# Altium project FelineFeast.PrjPcb (part 2 of 2)

## Sheet 4_WiFi.SchDoc: ESP8266-12E WiFi Controller
size A4; DrawnBy: Denis Cooper; Organization: felinefeast.org; Revision: 1.0; SheetNumber: 4; SheetTotal: 5
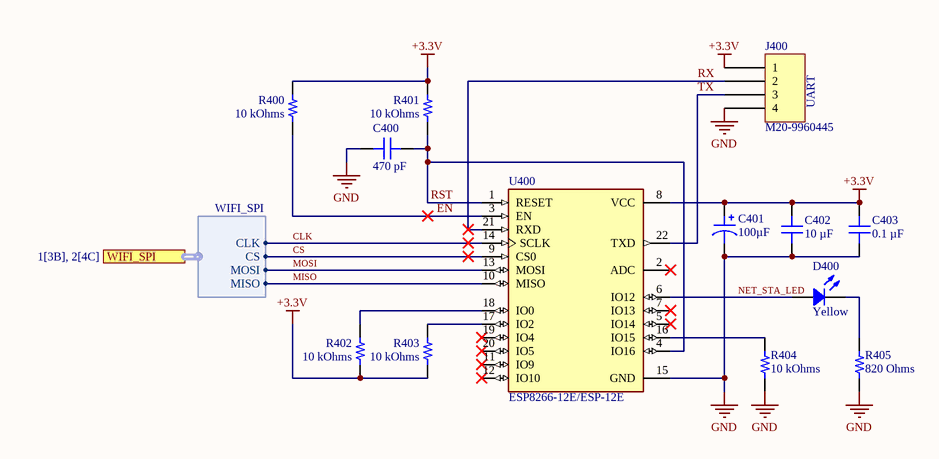
[diagram p3: 4_WiFi.SchDoc]

### Parts
C400  470 pF  [CAP 0603_1608]
C401  100µF  [CAP POL 2917_7343]
C402  10 µF  [CAP 0805_2012]
C403  0.1 µF  [CAP 0603_1608]
D400  Yellow  [LED 0603_1608 YELLOW]
J400  M20-9960445  [HARWIN M20-9960445]
R400  10 kOhms  [RES 0603_1608]
R401  10 kOhms  [RES 0603_1608]
R402  10 kOhms  [RES 0603_1608]
R403  10 kOhms  [RES 0603_1608]
R404  10 kOhms  [RES 0603_1608]
R405  820 Ohms  [RES 0603_1608]
U400  ESP8266-12E/ESP-12E  [XCVR_ESP8266-12E/ESP-12E]

### Ports
WIFI_SPI (harness WIFI_SPI, see 1[3B], 2[4C])

### Harnesses
WIFI_SPI: CLK, CS, MOSI, MISO

### Nets
+3.3V: C401.1 C402.1 C403.2 J400.1 R400.2 R401.2 R402.1 R403.1 U400.8(VCC)
GND: C400.1 C401.2 C402.2 C403.1 J400.4 R404.1 R405.1 U400.15(GND)
CLK: U400.14(SCLK) ; port WIFI_SPI.CLK
CS: U400.9(CS0) ; port WIFI_SPI.CS
EN: R400.1 U400.3(EN)
MISO: U400.10(MISO) ; port WIFI_SPI.MISO
MOSI: U400.13(MOSI) ; port WIFI_SPI.MOSI
NET_STA_LED: D400.1 U400.6(IO12)
RST: C400.2 R401.1 U400.1(RESET) U400.4(IO16)
RX: J400.2 U400.21(RXD)
TX: J400.3 U400.22(TXD)
NetD400_2: D400.2 R405.2
NetR402_2: R402.2 U400.18(IO0)
NetR403_2: R403.2 U400.17(IO2)
NetR404_2: R404.2 U400.16(IO15)

Not connected (* = marked no-connect by the designer): U400 2(ADC)* 5(IO14)* 7(IO13)* 11(IO9)* 12(IO10)* 19(IO4)* 20(IO5)*

### Notes on the sheet
- (near J400) UART

### Library data of the parts
C400 = CL10B471KB8NNNC: CAP CER 470PF 50V X7R 0603; manufacturer: Samsung Electro-Mechanics; Tolerance: ±10%; Part Number: CL10B471KB8NNNC; Capacitance: 470 pF; Applications: General Purpose; componentlink1description: Datasheet; componentlink1url: http://www.samsungsem.com/kr/support/product-search/mlcc/CL10B471KB8NNNC.jsp; componentlink2description: DigiKey Link; componentlink2url: https://www.digikey.com/en/products/detail/samsung-electro-mechanics/CL10B471KB8NNNC/3886752; Device Package: 0603 (1608 Metric); lastupdated: 09.02.2024 20:10:20; Lifecycle Status: Active; Minimum Order: 1; Mounting Type: Surface Mount, MLCC; Operating Temperature: -55°C ~ 125°C; Package / Case: 0603 (1608 Metric); packaging: TapeAndReel; partid: 9822; Part Status: Active; price: 0.01; series: CL; Size / Dimension: 0.063" L x 0.031" W (1.60mm x 0.80mm); Supplier 1: DigiKey; Supplier Part Number 1: 1276-1094-1-ND; Temperature Coefficient: X7R; Thickness (Max): 0.035" (0.90mm); value: 470 pF; Voltage - Rated: 50V
C401 = TAJD107K016RNJ: CAP TANT 100UF 10% 16V 2917; manufacturer: AVX Corporation; Manufacturer Size Code: D; ESR (Equivalent Series Resistance): 600mOhm; Type: Molded; Part Number: TAJD107K016RNJ; Value: 100µF; Capacitance: 100µF; componentlink1description: Datasheet; componentlink1url: http://datasheets.avx.com/TAJ.pdf; componentlink2description: DigiKey Link; componentlink2url: http://digikey.com/product-detail/en/avx-corporation/TAJD107K016RNJ/478-1723-1-ND/564755; Device Package: 2917 (7343 Metric); Features: General Purpose; Height - Seated (Max): 0.122" (3.10mm); lastupdated: 02.09.2020 1:16:19; Lifecycle Status: Active; Minimum Order: 1; Mounting Type: Surface Mount; Operating Temperature: -55°C ~ 125°C; Package / Case: 2917 (7343 Metric); packaging: TapeAndReel; partid: 1445; Part Status: Active; price: 0.35; series: TAJ; Size / Dimension: 0.287" L x 0.169" W (7.30mm x 4.30mm); Supplier 1: DigiKey; Supplier Part Number 1: 478-1723-1-ND; Tolerance: ±10%; Voltage - Rated: 16V
C402 = CL21B106KPQNNNE: CAP CER 10UF 10V X7R 0805; manufacturer: Samsung Electro-Mechanics; Tolerance: ±10%; Part Number: CL21B106KPQNNNE; Capacitance: 10 µF; Applications: General Purpose; componentlink1description: Datasheet; componentlink1url: http://www.samsungsem.com/kr/support/product-search/mlcc/CL21B106KPQNNNE.jsp; componentlink2description: DigiKey Link; componentlink2url: https://www.digikey.com/en/products/detail/samsung-electro-mechanics/CL21B106KPQNNNE/3887422; Device Package: 0805 (2012 Metric); lastupdated: 09.02.2024 20:15:41; Lifecycle Status: Active; Minimum Order: 1; Mounting Type: Surface Mount, MLCC; Operating Temperature: -55°C ~ 125°C; Package / Case: 0805 (2012 Metric); packaging: TapeAndReel; partid: 13130; Part Status: Active; price: 0.02; series: CL; Size / Dimension: 0.079" L x 0.049" W (2.00mm x 1.25mm); Supplier 1: DigiKey; Supplier Part Number 1: 1276-1764-1-ND; Temperature Coefficient: X7R; Thickness (Max): 0.055" (1.40mm); value: 10 µF; Voltage - Rated: 10V
C403 = CL10B104KA8NNNC: CAP CER 0.1UF 25V X7R 0603; manufacturer: Samsung Electro-Mechanics; Tolerance: ±10%; Part Number: CL10B104KA8NNNC; Capacitance: 0.1 µF; Applications: General Purpose; componentlink1description: Datasheet; componentlink1url: http://www.samsungsem.com/kr/support/product-search/mlcc/CL10B104KA8NNNC.jsp; componentlink2description: DigiKey Link; componentlink2url: https://www.digikey.com/en/products/detail/samsung-electro-mechanics/CL10B104KA8NNNC/3886664; Device Package: 0603 (1608 Metric); lastupdated: 09.02.2024 20:10:20; Lifecycle Status: Active; Minimum Order: 1; Mounting Type: Surface Mount, MLCC; Operating Temperature: -55°C ~ 125°C; Package / Case: 0603 (1608 Metric); packaging: TapeAndReel; partid: 9793; Part Status: Active; price: 0.01; series: CL; Size / Dimension: 0.063" L x 0.031" W (1.60mm x 0.80mm); Supplier 1: DigiKey; Supplier Part Number 1: 1276-1006-1-ND; Temperature Coefficient: X7R; Thickness (Max): 0.035" (0.90mm); value: 0.1 µF; Voltage - Rated: 25V
D400 = LY L29K-H1K2-26-Z: LED YELLOW DIFFUSED 0603 SMD; Manufacturer: OSRAM Opto Semiconductors Inc.; Configuration: Standard; Current - Test: 2mA; Lens Color: White; Lens Size: 1.30mm x 0.80mm; Lens Style: Rectangle with Flat Top; Millicandela Rating: 7mcd; Viewing Angle: 160°; Voltage - Forward (Vf) (Typ): 1.8V; Wavelength - Dominant: 587nm; Wavelength - Peak: 591nm; Part Number: LY L29K-H1K2-26-Z; Color: Yellow; ComponentLink1Description: Datasheet; ComponentLink1URL: https://dammedia.osram.info/media/resource/hires/osram-dam-2492957/LY%20L29K.pdf; ComponentLink2Description: DigiKey Link; ComponentLink2URL: https://www.digikey.com/en/products/detail/osram-opto-semiconductors-inc/LY-L29K-H1K2-26-Z/810340; Device Package: 0603 (1608 Metric); Height (Max): 0.65mm; LastUpdated: 03.06.2024 20:01:09; Lens Transparency: Diffused; Lifecycle Status: Active; Minimum Order: 1; Mounting Type: Surface Mount; Package / Case: 0603 (1608 Metric); Packaging: TapeAndReel; PartId: 140; Part Status: Active; Price: 0.07; Series: SMARTLED® 0603; Size / Dimension: 1.70mm L x 0.80mm W; Supplier 1: DigiKey; Supplier Part Number 1: 475-1196-1-ND; Supplier Device Package: 0603; Value: Yellow
J400 = M20-9960445: CONN HEADER R/A 4POS 2.54MM; Manufacturer: Harwin Inc.; Connector Type: Header, Cuttable; Contact Length - Mating: 0.240" (6.10mm); Contact Length - Post: 0.118" (3.00mm); Current Rating (Amps): 3A per Contact; Material Flammability Rating: UL94 V-0; Number of Positions: 4; Number of Positions Loaded: All; Pitch - Mating: 0.100" (2.54mm); Row Spacing - Mating: -40°C ~ 105°C; Shrouding: Unshrouded; Style: Board to Board or Cable; Part Number: M20-9960445; ComponentLink1Description: Datasheet; ComponentLink1URL: https://cdn.harwin.com/pdfs/Harwin_PC_Connectors_M20.pdf; ComponentLink2Description: DigiKey Link; ComponentLink2URL: https://www.digikey.com/en/products/detail/harwin-inc/M20-9960445/3921052; Contact Finish - Mating: Gold; Contact Material: Brass; Contact Shape: Square; Contact Type: Male Pin; Fastening Type: Push-Pull; Insulation Color: Black; Insulation Height: 0.100" (2.54mm); Insulation Material: Polyamide (PA6T), Nylon 6T; LastUpdated: 21.09.2022 19:23:20; Lifecycle Status: Active; Minimum Order: 1; Mounting Type: Through Hole, Right Angle; Number of Rows: 1; Operating Temperature: -40°C ~ 105°C; Packaging: Bulk; PartId: 167; Part Status: Active; Price: 0.11; Series: M20; Supplier 1: DigiKey; Supplier Part Number 1: 952-3286-ND; Termination: Solder
R400-R404 = ERJ-P03F1002V: RES SMD 10 KOHM 1% 1/5W 0603; Manufacturer: Panasonic Electronic Components; Power (Watts): 0.2W, 1/5W; Temperature Coefficient: ±200ppm/°C; Part Number: ERJ-P03F1002V; Value: 10 kOhms; ComponentLink1Description: Datasheet; ComponentLink1URL: https://industrial.panasonic.com/cdbs/www-data/pdf/RDO0000/AOA0000C331.pdf; ComponentLink2Description: DigiKey Link; ComponentLink2URL: https://www.digikey.com/en/products/detail/panasonic-electronic-components/ERJ-P03F1002V/9810215; Composition: Thick Film; Device Package: 0603 (1608 Metric); Features: Automotive AEC-Q200, Pulse Withstanding; Height - Seated (Max): 0.022" (0.55mm); LastUpdated: 09.02.2024 20:40:33; Lifecycle Status: Active; Minimum Order: 1; Number of Terminations: 2; Operating Temperature: -55°C ~ 155°C; Package / Case: 0603 (1608 Metric); Packaging: TapeAndReel; PartId: 82212; Price: 0.03; Ratings: AEC-Q200; Resistance: 10 kOhms; Series: ERJ-P03; Size / Dimension: 0.063" L x 0.031" W (1.60mm x 0.80mm); Supplier 1: DigiKey; Supplier Part Number 1: 10-ERJ-P03F1002VCT-ND; Supplier Device Package: 0603; Tolerance: ±1%
R405 = ERJ-3EKF8200V: RES SMD 820 OHM 1% 1/10W 0603; Manufacturer: Panasonic Electronic Components; Power (Watts): 0.1W, 1/10W; Temperature Coefficient: ±100ppm/°C; Part Number: ERJ-3EKF8200V; Value: 820 Ohms; ComponentLink1Description: Datasheet; ComponentLink1URL: https://industrial.panasonic.com/cdbs/www-data/pdf/RDA0000/AOA0000C304.pdf; ComponentLink2Description: DigiKey Link; ComponentLink2URL: https://www.digikey.com/en/products/detail/panasonic-electronic-components/ERJ-3EKF8200V/1746447; Composition: Thick Film; Device Package: 0603 (1608 Metric); Features: Automotive AEC-Q200; Height - Seated (Max): 0.022" (0.55mm); LastUpdated: 09.02.2024 20:41:57; Lifecycle Status: Active; Minimum Order: 1; Number of Terminations: 2; Operating Temperature: -55°C ~ 155°C; Package / Case: 0603 (1608 Metric); Packaging: TapeAndReel; PartId: 25993; Part Status: Active; Price: 0.01; Ratings: AEC-Q200; Resistance: 820 Ohms; Series: ERJ-3EK; Size / Dimension: 0.063" L x 0.031" W (1.60mm x 0.80mm); Supplier 1: DigiKey; Supplier Part Number 1: P820HCT-ND; Supplier Device Package: 0603; Tolerance: ±1%
U400 = ESP8266-12E/ESP-12E: This WiFi module has a 32-bit MCU micro and clock speeds supporting 80 MHz or 160 MHz. Supports the RTOS and integrated Wi-Fi MAC/BB/RF/PA/LNA, and has an on-board antenna.; MF: AI-Thinker; Value: *; SnapEDA_Link: https://www.snapeda.com/parts/ESP8266-12E/ESP-12E/AI-Thinker/view-part/?ref=snap; Availability: Not in stock; Price: None; Package: None; Check_prices: https://www.snapeda.com/parts/ESP8266-12E/ESP-12E/AI-Thinker/view-part/?ref=eda; MP: ESP8266-12E/ESP-12E

## Sheet 5_StepperMotorDriver.SchDoc: Stepper Motor Driver
size A4; DrawnBy: Denis Cooper; Organization: felinefeast.org; Revision: 1.0; SheetNumber: 5; SheetTotal: 5
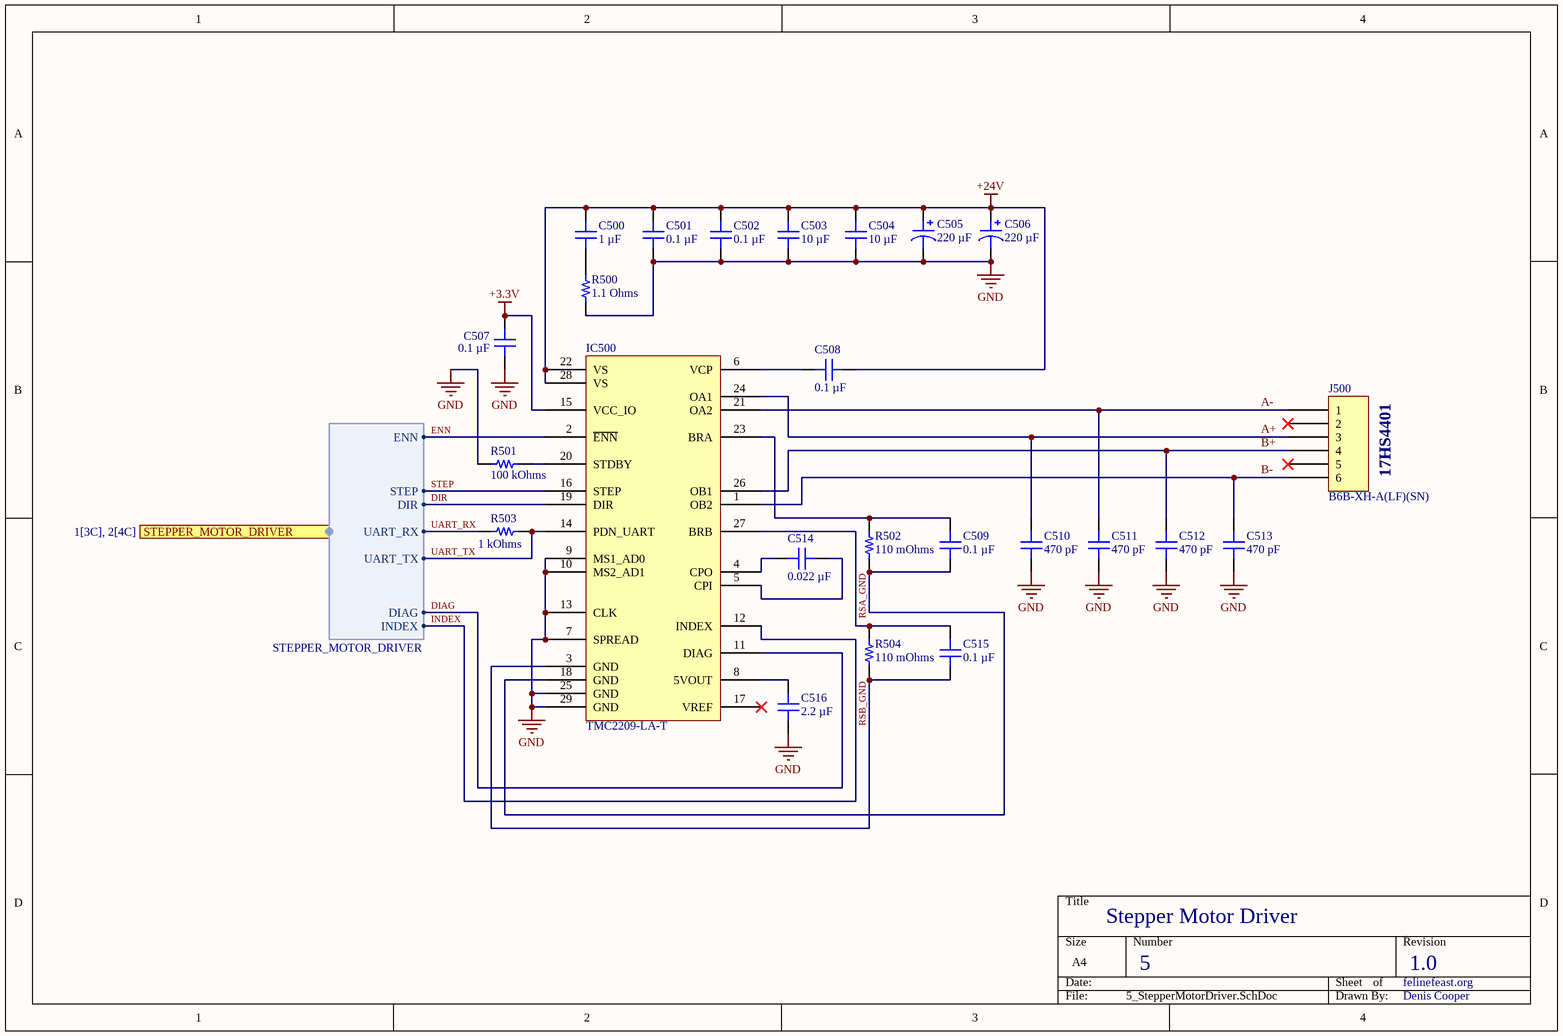
[diagram p4: 5_StepperMotorDriver.SchDoc]

### Parts
C500  1 µF  [CAP 1210_3225 - 1MM]
C501  0.1 µF  [CAP 0603_1608]
C502  0.1 µF  [CAP 0603_1608]
C503  10 µF  [CAP 1206_3216 - 0.8MM]
C504  10 µF  [CAP 1206_3216 - 0.8MM]
C505  220 µF  [CAP ALSMD 8.3MM H10.5MM]
C506  220 µF  [CAP ALSMD 8.3MM H10.5MM]
C507  0.1 µF  [CAP 0603_1608]
C508  0.1 µF  [CAP 0603_1608]
C509  0.1 µF  [CAP 0603_1608]
C510  470 pF  [CAP 0603_1608]
C511  470 pF  [CAP 0603_1608]
C512  470 pF  [CAP 0603_1608]
C513  470 pF  [CAP 0603_1608]
C514  0.022 µF  [CAP 0603_1608]
C515  0.1 µF  [CAP 0603_1608]
C516  2.2 µF  [CAP 0603_1608]
IC500  TMC2209-LA-T  [TRINAMIC QFN28 TMC2209-LA]
J500  B6B-XH-A(LF)(SN)  [JST XH B6B-XH-A]
R500  1.1 Ohms  [YAGEO RES 0603_1608]
R501  100 kOhms  [RES 0603_1608]
R502  110 mOhms  [RES 1210_3225]
R503  1 kOhms  [RES 0603_1608]
R504  110 mOhms  [RES 1210_3225]

### Ports
STEPPER_MOTOR_DRIVER (harness STEPPER_MOTOR_DRIVER, see 1[3C], 2[4C])

### Harnesses
STEPPER_MOTOR_DRIVER: STEP, DIR, UART_TX, ENN, INDEX, DIAG, UART_RX

### Nets
+3.3V: C507.2 IC500.15(VCC_IO)
+24V: C500.2 C501.2 C502.2 C503.2 C504.2 C505.1 C506.1 C508.1 IC500.22(VS) IC500.28(VS)
GND: C501.1 C502.1 C503.1 C504.1 C505.2 C506.2 C507.1 C510.1 C511.1 C512.1 C513.1 C516.1 IC500.7(SPREAD) IC500.9(MS1_AD0) IC500.10(MS2_AD1) IC500.13(CLK) IC500.25(GND) IC500.29(GND) R500.1 R501.2
A+: C510.2 IC500.24(OA1) J500.3
A-: C511.2 IC500.21(OA2) J500.1
B+: C512.2 IC500.26(OB1) J500.4
B-: C513.2 IC500.1(OB2) J500.6
DIAG: IC500.11(DIAG) ; port STEPPER_MOTOR_DRIVER.DIAG
DIR: IC500.19(DIR) ; port STEPPER_MOTOR_DRIVER.DIR
ENN: IC500.2(~{ENN}) ; port STEPPER_MOTOR_DRIVER.ENN
INDEX: IC500.12(INDEX) ; port STEPPER_MOTOR_DRIVER.INDEX
RSA_GND: C509.2 IC500.18(GND) R502.1
RSB_GND: C515.2 IC500.3(GND) R504.1
STEP: IC500.16(STEP) ; port STEPPER_MOTOR_DRIVER.STEP
UART_RX: R503.1 ; port STEPPER_MOTOR_DRIVER.UART_RX
UART_TX: IC500.14(PDN_UART) R503.2 ; port STEPPER_MOTOR_DRIVER.UART_TX
NetC500_1: C500.1 R500.2
NetC508_2: C508.2 IC500.6(VCP)
NetC509_1: C509.1 IC500.23(BRA) R502.2
NetC514_1: C514.1 IC500.4(CPO)
NetC514_2: C514.2 IC500.5(CPI)
NetC515_1: C515.1 IC500.27(BRB) R504.2
NetC516_2: C516.2 IC500.8(5VOUT)
NetIC500_20: IC500.20(STDBY) R501.1

Not connected (* = marked no-connect by the designer): IC500 17(VREF)*; J500 2* 5*

### Notes on the sheet
- (near J500) 17HS4401

### Library data of the parts
C500 = CL32B105KBHNNNE: CAP CER 1UF 50V X7R 1210; manufacturer: Samsung Electro-Mechanics; Tolerance: ±10%; Part Number: CL32B105KBHNNNE; Value: 1 µF; Applications: General Purpose; Capacitance: 1 µF; componentlink1description: Datasheet; componentlink1url: http://www.samsungsem.com/kr/support/product-search/mlcc/CL32B105KBHNNNE.jsp; componentlink2description: DigiKey Link; componentlink2url: https://www.digikey.com/en/products/detail/samsung-electro-mechanics/CL32B105KBHNNNE/3887469; Device Package: 1210 (3225 Metric); lastupdated: 04.06.2024 19:21:02; Lifecycle Status: Active; Minimum Order: 1; Mounting Type: Surface Mount, MLCC; Operating Temperature: -55°C ~ 125°C; Package / Case: 1210 (3225 Metric); packaging: TapeAndReel; partid: 24761; Part Status: Active; price: 0.03; series: CL; Size / Dimension: 0.126" L x 0.098" W (3.20mm x 2.50mm); Supplier 1: DigiKey; Supplier Part Number 1: 1276-1811-1-ND; Temperature Coefficient: X7R; Thickness (Max): 0.071" (1.80mm); Voltage - Rated: 50V
C501 C502 C507-C509 C515 = CL10B104KB8NNNC: CAP CER 0.1UF 50V X7R 0603; manufacturer: Samsung Electro-Mechanics; Tolerance: ±10%; Part Number: CL10B104KB8NNNC; Capacitance: 0.1 µF; Applications: General Purpose; componentlink1description: Datasheet; componentlink1url: http://www.samsungsem.com/kr/support/product-search/mlcc/CL10B104KB8NNNC.jsp; componentlink2description: DigiKey Link; componentlink2url: https://www.digikey.com/en/products/detail/samsung-electro-mechanics/CL10B104KB8NNNC/3886658; Device Package: 0603 (1608 Metric); lastupdated: 09.02.2024 20:10:20; Lifecycle Status: Active; Minimum Order: 1; Mounting Type: Surface Mount, MLCC; Operating Temperature: -55°C ~ 125°C; Package / Case: 0603 (1608 Metric); packaging: TapeAndReel; partid: 9788; Part Status: Active; price: 0.01; series: CL; Size / Dimension: 0.063" L x 0.031" W (1.60mm x 0.80mm); Supplier 1: DigiKey; Supplier Part Number 1: 1276-1000-1-ND; Temperature Coefficient: X7R; Thickness (Max): 0.035" (0.90mm); value: 0.1 µF; Voltage - Rated: 50V
C503 C504 = CL31B106KBHNNNE: CAP CER 10UF 50V X7R 1206; manufacturer: Samsung Electro-Mechanics; Tolerance: ±10%; Part Number: CL31B106KBHNNNE; Capacitance: 10 µF; Applications: General Purpose; componentlink1description: Datasheet; componentlink1url: http://www.samsungsem.com/kr/support/product-search/mlcc/CL31B106KBHNNNE.jsp; componentlink2description: DigiKey Link; componentlink2url: https://www.digikey.com/en/products/detail/samsung-electro-mechanics/CL31B106KBHNNNE/5961251; Device Package: 1206 (3216 Metric); lastupdated: 04.06.2024 19:10:41; Lifecycle Status: Active; Minimum Order: 1; Mounting Type: Surface Mount, MLCC; Operating Temperature: -55°C ~ 125°C; Package / Case: 1206 (3216 Metric); packaging: TapeAndReel; partid: 40563; Part Status: Active; price: 0.06; series: CL; Size / Dimension: 0.126" L x 0.063" W (3.20mm x 1.60mm); Supplier 1: DigiKey; Supplier Part Number 1: 1276-6767-1-ND; Temperature Coefficient: X7R; Thickness (Max): 0.071" (1.80mm); value: 10 µF; Voltage - Rated: 50V
C505 C506 = EEE-FT1H221GP: CAP ALUM 220UF 20% 50V SMD; manufacturer: Panasonic Electronic Components; ESR (Equivalent Series Resistance): 180mOhm @ 100kHz; Lifetime @ Temp.: 5000 Hrs @ 105°C; Polarization: Polar; Ripple Current @ High Frequency: 670 mA @ 100 kHz; Ripple Current @ Low Frequency: 435.5 mA @ 120 Hz; Surface Mount Land Size: 0.327" L x 0.327" W (8.30mm x 8.30mm); Part Number: EEE-FT1H221GP; Applications: Automotive; Capacitance: 220 µF; componentlink1description: Datasheet; componentlink1url: https://na.industrial.panasonic.com/file-download/3112; componentlink2description: DigiKey Link; componentlink2url: https://www.digikey.com/en/products/detail/panasonic-electronic-components/EEE-FT1H221GP/6048908; Device Package: Radial, Can - SMD; Height - Seated (Max): 0.413" (10.50mm); lastupdated: 03.06.2024 20:15:48; Lifecycle Status: Active; Minimum Order: 1; Mounting Type: Surface Mount; Operating Temperature: -55°C ~ 105°C; Package / Case: Radial, Can - SMD; packaging: TapeAndReel; partid: 7501; Part Status: Active; price: 0.33; Ratings: AEC-Q200; series: FT; Size / Dimension: 0.315" Dia (8.00mm); Supplier 1: DigiKey; Supplier Part Number 1: PCE5120CT-ND; Tolerance: ±20%; value: 220 µF; Voltage - Rated: 50 V
C510-C513 = CL10C471JB8NNNC: CAP CER 470PF 50V C0G/NP0 0603; manufacturer: Samsung Electro-Mechanics; Temperature Coefficient: C0G, NP0; Tolerance: ±5%; Part Number: CL10C471JB8NNNC; Capacitance: 470 pF; Applications: General Purpose; componentlink1description: Datasheet; componentlink1url: http://www.samsungsem.com/kr/support/product-search/mlcc/CL10C471JB8NNNC.jsp; componentlink2description: DigiKey Link; componentlink2url: https://www.digikey.com/en/products/detail/samsung-electro-mechanics/CL10C471JB8NNNC/3886826; Device Package: 0603 (1608 Metric); lastupdated: 09.02.2024 20:10:27; Lifecycle Status: Active; Minimum Order: 1; Mounting Type: Surface Mount, MLCC; Operating Temperature: -55°C ~ 125°C; Package / Case: 0603 (1608 Metric); packaging: TapeAndReel; partid: 5135; Part Status: Active; price: 0.01; series: CL; Size / Dimension: 0.063" L x 0.031" W (1.60mm x 0.80mm); Supplier 1: DigiKey; Supplier Part Number 1: 1276-1168-1-ND; Thickness (Max): 0.035" (0.90mm); value: 470 pF; Voltage - Rated: 50V
C514 = CL10B223KB8NNNC: CAP CER 0.022UF 50V X7R 0603; manufacturer: Samsung Electro-Mechanics; Tolerance: ±10%; Part Number: CL10B223KB8NNNC; Capacitance: 0.022 µF; Applications: General Purpose; componentlink1description: Datasheet; componentlink1url: http://www.samsungsem.com/kr/support/product-search/mlcc/CL10B223KB8NNNC.jsp; componentlink2description: DigiKey Link; componentlink2url: https://www.digikey.com/en/products/detail/samsung-electro-mechanics/CL10B223KB8NNNC/3886762; Device Package: 0603 (1608 Metric); lastupdated: 09.02.2024 20:10:20; Lifecycle Status: Active; Minimum Order: 1; Mounting Type: Surface Mount, MLCC; Operating Temperature: -55°C ~ 125°C; Package / Case: 0603 (1608 Metric); packaging: TapeAndReel; partid: 9905; Part Status: Active; price: 0.01; series: CL; Size / Dimension: 0.063" L x 0.031" W (1.60mm x 0.80mm); Supplier 1: DigiKey; Supplier Part Number 1: 1276-1104-1-ND; Temperature Coefficient: X7R; Thickness (Max): 0.035" (0.90mm); value: 0.022 µF; Voltage - Rated: 50V
C516 = CL10A225KQ8NNNC: CAP CER 2.2UF 6.3V X5R 0603; manufacturer: Samsung Electro-Mechanics; Tolerance: ±10%; Part Number: CL10A225KQ8NNNC; Capacitance: 2.2 µF; Applications: General Purpose; componentlink1description: Datasheet; componentlink1url: http://www.samsungsem.com/kr/support/product-search/mlcc/CL10A225KQ8NNNC.jsp; componentlink2description: DigiKey Link; componentlink2url: https://www.digikey.com/en/products/detail/samsung-electro-mechanics/CL10A225KQ8NNNC/3886841; Device Package: 0603 (1608 Metric); lastupdated: 09.02.2024 20:10:16; Lifecycle Status: Active; Minimum Order: 1; Mounting Type: Surface Mount, MLCC; Operating Temperature: -55°C ~ 85°C; Package / Case: 0603 (1608 Metric); packaging: TapeAndReel; partid: 13106; Part Status: Active; price: 0.01; series: CL; Size / Dimension: 0.063" L x 0.031" W (1.60mm x 0.80mm); Supplier 1: DigiKey; Supplier Part Number 1: 1276-1183-1-ND; Temperature Coefficient: X5R; Thickness (Max): 0.035" (0.90mm); value: 2.2 µF; Voltage - Rated: 6.3V
IC500 = TMC2209-LA-T: IC MTR DRV 4.75-28V QFN28; Manufacturer: Trinamic Motion Control GmbH; Current - Output: 2A; Function: Driver - Fully Integrated, Control and Power Stage; Interface: Step/Direction, UART; Motor Type - Stepper: Bipolar; Output Configuration: Step/Direction; Step Resolution: 1 ~ 1/256; Voltage - Load: 5.5V ~ 29V; Voltage - Supply: 4.8V ~ 5.25V; Part Number: TMC2209-LA-T; Applications: Automation Control; ComponentLink1Description: Datasheet; ComponentLink1URL: https://www.trinamic.com/fileadmin/assets/Products/ICs_Documents/TMC2209_Datasheet_V103.pdf; ComponentLink2Description: DigiKey Link; ComponentLink2URL: https://www.digikey.com/en/products/detail/trinamic-motion-control-gmbh/TMC2209-LA-T/10232491; LastUpdated: 01.10.2022 11:24:54; Lifecycle Status: Active; Minimum Order: 1; Mounting Type: Surface Mount; Operating Temperature: -40°C ~ 125°C (TJ); Package / Case: 28-VFQFN Exposed Pad; Packaging: TapeAndReel; PartId: 13; Part Status: Active; Price: 1.91; Series: stallGuard™; Supplier 1: DigiKey; Supplier Part Number 1: 1460-1398-1-ND; Supplier Device Package: 28-QFN (5x5); Technology: Power MOSFET
J500 = B6B-XH-A(LF)(SN): CONN HEADER VERT 6POS 2.5MM; Manufacturer: JST Sales America Inc.; Contact Length - Post: 0.134" (3.40mm); Current Rating (Amps): 3A; Material Flammability Rating: UL94 V-0; Number of Positions: 6; Number of Positions Loaded: All; Pitch - Mating: 0.098" (2.50mm); Shrouding: Shrouded - 4 Wall; Style: Board to Cable/Wire; Voltage Rating: 250V; Part Number: B6B-XH-A(LF)(SN); ComponentLink1Description: Datasheet; ComponentLink1URL: http://www.jst-mfg.com/product/pdf/eng/eXH.pdf; ComponentLink2Description: DigiKey Link; ComponentLink2URL: http://digikey.com/product-detail/en/jst-sales-america-inc/B6B-XH-A-LF-SN/455-2271-ND/1000381; Connector Type: Header; Contact Finish - Mating: Tin; Contact Finish - Post: Tin; Contact Material: Brass; Contact Shape: Square; Contact Type: Male Pin; Fastening Type: Detent Lock; Insulation Color: Natural; Insulation Height: 0.276" (7.00mm); Insulation Material: Polyamide (PA66), Nylon 6/6; LastUpdated: 12.01.2020 23:46:58; Lifecycle Status: Active; Minimum Order: 1; Mounting Type: Through Hole; Number of Rows: 1; Operating Temperature: -25°C ~ 85°C; Packaging: Bulk; PartId: 71; Part Status: Active; Price: 0.27; Series: XH; Supplier 1: DigiKey; Supplier Part Number 1: 455-2271-ND; Termination: Press-Fit, Solder
R500 = RC0603FR-071R1L: RES 1.1 OHM 1% 1/10W 0603; Manufacturer: Yageo; Power (Watts): 0.1W, 1/10W; Temperature Coefficient: ±200ppm/°C; Part Number: RC0603FR-071R1L; Value: 1.1 Ohms; ComponentLink1Description: Datasheet; ComponentLink1URL: https://www.yageo.com/upload/media/product/productsearch/datasheet/rchip/PYu-RC_Group_51_RoHS_L_11.pdf; ComponentLink2Description: DigiKey Link; ComponentLink2URL: https://www.digikey.com/en/products/detail/yageo/RC0603FR-071R1L/5918279; Composition: Thick Film; Device Package: 0603 (1608 Metric); Features: Moisture Resistant; Height - Seated (Max): 0.022" (0.55mm); LastUpdated: 25.07.2024 9:19:12; Lifecycle Status: Active; Minimum Order: 1; Number of Terminations: 2; Operating Temperature: -55°C ~ 155°C; Package / Case: 0603 (1608 Metric); Packaging: TapeAndReel; PartId: 61999; Part Status: Active; Price: 0.01; Resistance: 1.1 Ohms; Series: RC_L; Size / Dimension: 0.063" L x 0.031" W (1.60mm x 0.80mm); Supplier 1: DigiKey; Supplier Part Number 1: 13-RC0603FR-071R1LCT-ND; Supplier Device Package: 0603; Tolerance: ±1%
R501 = ERJ-3EKF1003V: RES SMD 100K OHM 1% 1/10W 0603; Manufacturer: Panasonic Electronic Components; Power (Watts): 0.1W, 1/10W; Temperature Coefficient: ±100ppm/°C; Part Number: ERJ-3EKF1003V; Value: 100 kOhms; ComponentLink1Description: Datasheet; ComponentLink1URL: https://industrial.panasonic.com/cdbs/www-data/pdf/RDA0000/AOA0000C304.pdf; ComponentLink2Description: DigiKey Link; ComponentLink2URL: https://www.digikey.com/en/products/detail/panasonic-electronic-components/ERJ-3EKF1003V/196075; Composition: Thick Film; Device Package: 0603 (1608 Metric); Features: Automotive AEC-Q200; Height - Seated (Max): 0.022" (0.55mm); LastUpdated: 09.02.2024 20:41:59; Lifecycle Status: Active; Minimum Order: 1; Number of Terminations: 2; Operating Temperature: -55°C ~ 155°C; Package / Case: 0603 (1608 Metric); Packaging: TapeAndReel; PartId: 25699; Part Status: Active; Price: 0.01; Ratings: AEC-Q200; Resistance: 100 kOhms; Series: ERJ-3EK; Size / Dimension: 0.063" L x 0.031" W (1.60mm x 0.80mm); Supplier 1: DigiKey; Supplier Part Number 1: P100KHCT-ND; Supplier Device Package: 0603; Tolerance: ±1%
R502 R504 = RL1210FR-070R11L: RES 0.11 OHM 1% 1/2W 1210; Manufacturer: Yageo; Power (Watts): 0.5W, 1/2W; Temperature Coefficient: ±600ppm/°C; Part Number: RL1210FR-070R11L; ComponentLink1Description: Datasheet; ComponentLink1URL: https://www.yageo.com/upload/media/product/app/datasheet/rchip/pyu-rl_group_521_rohs_l.pdf; ComponentLink2Description: DigiKey Link; ComponentLink2URL: https://www.digikey.com/en/products/detail/yageo/RL1210FR-070R11L/5925206; Composition: Thick Film; Device Package: 1210 (3225 Metric); Features: Automotive AEC-Q200, Current Sense, Moisture Resistant; Height - Seated (Max): 0.026" (0.65mm); LastUpdated: 03.06.2024 20:18:34; Lifecycle Status: Active; Minimum Order: 1; Number of Terminations: 2; Operating Temperature: -55°C ~ 155°C; Package / Case: 1210 (3225 Metric); Packaging: TapeAndReel; Price: 0.07; Ratings: AEC-Q200; Resistance: 110 mOhms; Series: RL; Size / Dimension: 0.122" L x 0.102" W (3.10mm x 2.60mm); Supplier 1: DigiKey; Supplier Part Number 1: 13-RL1210FR-070R11LCT-ND; Supplier Device Package: 1210; Tolerance: ±1%; Value: 110 mOhms
R503 = ERJ-3EKF1001V: RES SMD 1K OHM 1% 1/10W 0603; Manufacturer: Panasonic Electronic Components; Power (Watts): 0.1W, 1/10W; Temperature Coefficient: ±100ppm/°C; Part Number: ERJ-3EKF1001V; Value: 1 kOhms; ComponentLink1Description: Datasheet; ComponentLink1URL: https://industrial.panasonic.com/cdbs/www-data/pdf/RDA0000/AOA0000C304.pdf; ComponentLink2Description: DigiKey Link; ComponentLink2URL: https://www.digikey.com/en/products/detail/panasonic-electronic-components/ERJ-3EKF1001V/196032; Composition: Thick Film; Device Package: 0603 (1608 Metric); Features: Automotive AEC-Q200; Height - Seated (Max): 0.022" (0.55mm); LastUpdated: 09.02.2024 20:42:00; Lifecycle Status: Active; Minimum Order: 1; Number of Terminations: 2; Operating Temperature: -55°C ~ 155°C; Package / Case: 0603 (1608 Metric); Packaging: TapeAndReel; PartId: 25687; Part Status: Active; Price: 0.01; Ratings: AEC-Q200; Resistance: 1 kOhms; Series: ERJ-3EK; Size / Dimension: 0.063" L x 0.031" W (1.60mm x 0.80mm); Supplier 1: DigiKey; Supplier Part Number 1: P1.00KHCT-ND; Supplier Device Package: 0603; Tolerance: ±1%

## Nets that join several sheets
+3.3V: 3_Power (C308.1 IC300.2 IC300.4), 2_MCU (12 pins), 4_WiFi (9 pins), 5_StepperMotorDriver (C507.2 IC500.15)
+24V: 3_Power (6 pins), 5_StepperMotorDriver (10 pins)
GND: 3_Power (20 pins), 2_MCU (26 pins), 4_WiFi (8 pins), 5_StepperMotorDriver (20 pins)
VBUS: 3_Power (U301.2), 2_MCU (J200.1)
CLK: 2_MCU (IC200.39), 4_WiFi (U400.14)
CS: 2_MCU (IC200.38), 4_WiFi (U400.9)
DIAG: 2_MCU (IC200.26), 5_StepperMotorDriver (IC500.11)
DIR: 2_MCU (IC200.22), 5_StepperMotorDriver (IC500.19)
ENN: 2_MCU (IC200.25), 5_StepperMotorDriver (IC500.2)
INDEX: 2_MCU (IC200.27), 5_StepperMotorDriver (IC500.12)
MISO: 2_MCU (IC200.40), 4_WiFi (U400.10)
MOSI: 2_MCU (IC200.41), 4_WiFi (U400.13)
NetIC200_18: 3_Power (U301.9), 2_MCU (IC200.18)
STEP: 2_MCU (IC200.21), 5_StepperMotorDriver (IC500.16)
UART_RX: 2_MCU (IC200.30), 5_StepperMotorDriver (R503.1)
UART_TX: 2_MCU (IC200.31), 5_StepperMotorDriver (IC500.14 R503.2)